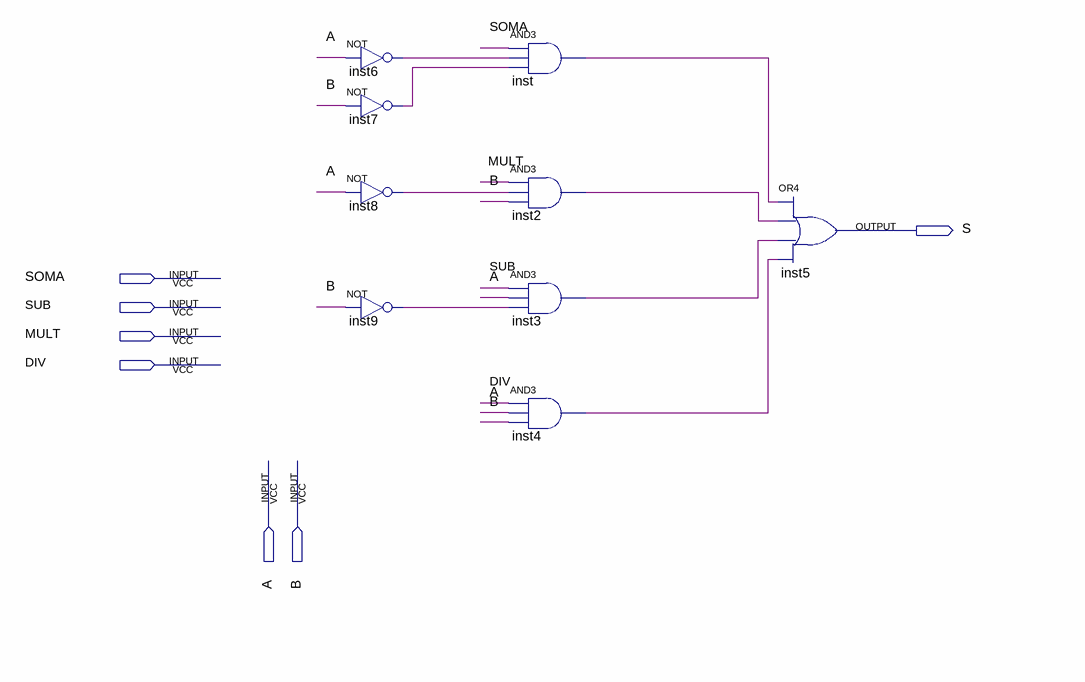
[diagram p0: schematic sheet]
// Quartus schematic multiplex4bits.bdf as structural Verilog: 9 symbols, 7 pins
module multiplex4bits (
  input  SOMA,
  input  SUB,
  input  MULT,
  input  DIV,
  input  A,
  input  B,
  output S
);

  wire inst2_out, inst3_out, inst4_out, inst6_out, inst7_out, inst8_out, inst9_out, inst_out;

  not inst6 (inst6_out, A);
  not inst7 (inst7_out, B);
  not inst8 (inst8_out, A);
  not inst9 (inst9_out, B);
  and inst (inst_out, SOMA, inst6_out, inst7_out);
  and inst2 (inst2_out, MULT, inst8_out, B);
  and inst3 (inst3_out, SUB, A, inst9_out);
  and inst4 (inst4_out, DIV, A, B);
  or inst5 (S, inst_out, inst2_out, inst3_out, inst4_out);
endmodule
